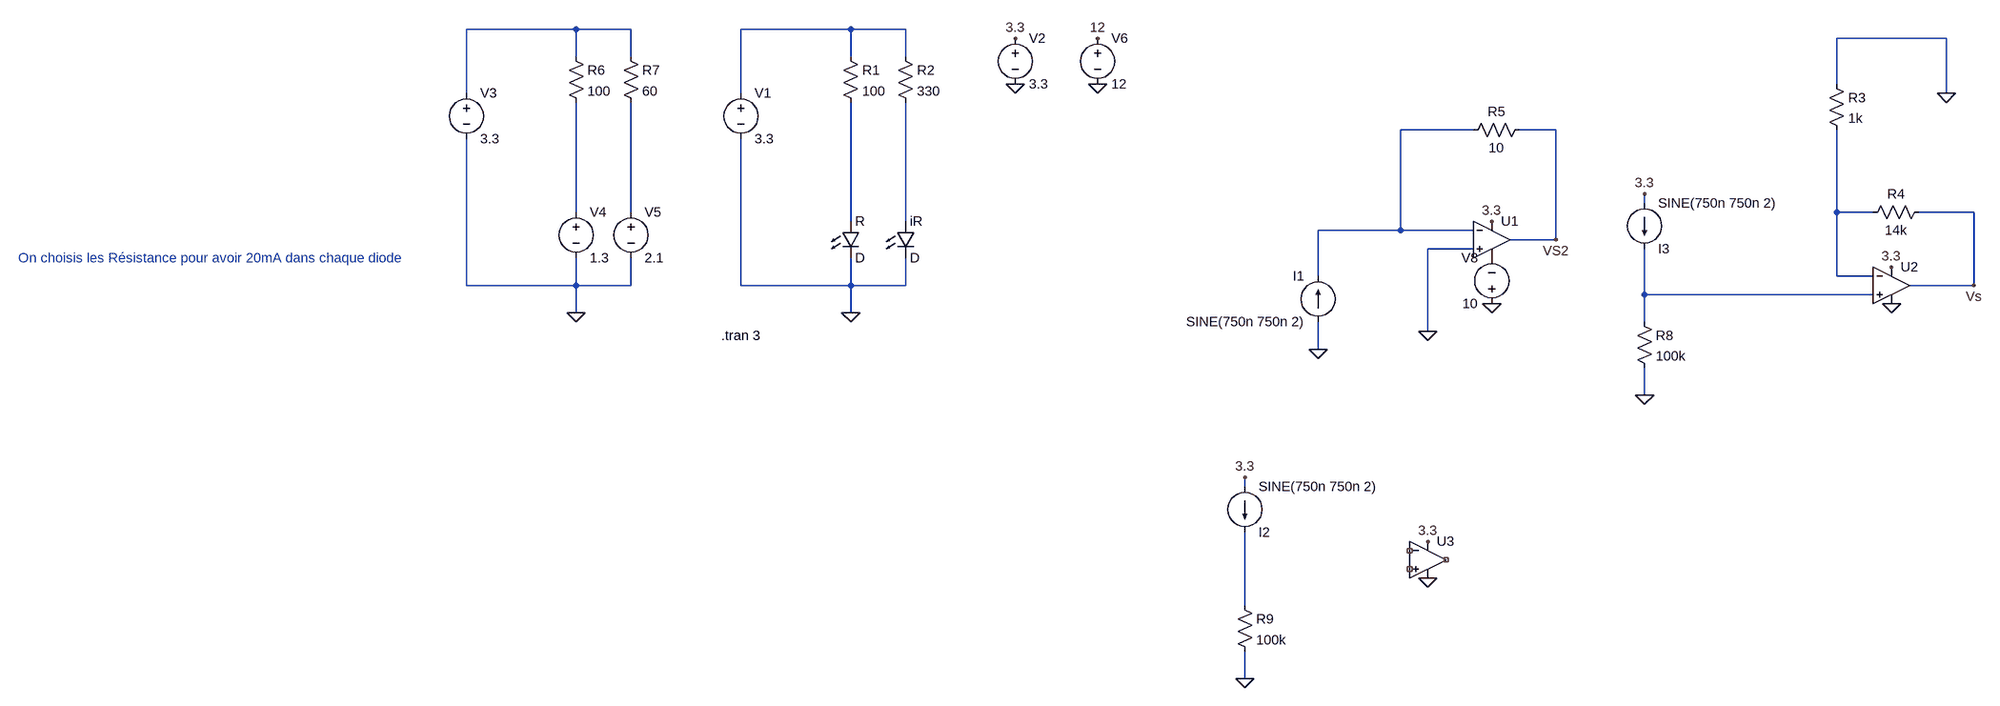
[diagram p0: schematic capteurs.asc]
capteurs.asc, the LTspice schematic file:
Version 4
SHEET 1 2576 916
WIRE -448 -240 -640 -240
WIRE -352 -240 -448 -240
WIRE 64 -240 -128 -240
WIRE 160 -240 64 -240
WIRE 2496 -224 2304 -224
WIRE -448 -192 -448 -240
WIRE -352 -192 -352 -240
WIRE 64 -192 64 -240
WIRE 160 -192 160 -240
WIRE 2304 -144 2304 -224
WIRE -640 -128 -640 -240
WIRE -128 -128 -128 -240
WIRE 2496 -128 2496 -224
WIRE 1232 -64 1104 -64
WIRE 1376 -64 1312 -64
WIRE 1968 64 1968 48
WIRE -448 80 -448 -112
WIRE -352 80 -352 -112
WIRE 2304 80 2304 -64
WIRE 2368 80 2304 80
WIRE 2544 80 2448 80
WIRE 64 96 64 -112
WIRE 160 96 160 -112
WIRE 1104 112 1104 -64
WIRE 1104 112 960 112
WIRE 1232 112 1104 112
WIRE 1376 128 1376 -64
WIRE 1376 128 1296 128
WIRE 1232 144 1152 144
WIRE 960 192 960 112
WIRE 2304 192 2304 80
WIRE 2368 192 2304 192
WIRE -640 208 -640 -48
WIRE -448 208 -448 160
WIRE -448 208 -640 208
WIRE -352 208 -352 160
WIRE -352 208 -448 208
WIRE -128 208 -128 -48
WIRE 64 208 64 160
WIRE 64 208 -128 208
WIRE 160 208 160 160
WIRE 160 208 64 208
WIRE 2544 208 2544 80
WIRE 2544 208 2432 208
WIRE 1968 224 1968 144
WIRE 2368 224 1968 224
WIRE -448 256 -448 208
WIRE 64 256 64 208
WIRE 1968 272 1968 224
WIRE 1152 288 1152 144
WIRE 960 320 960 272
WIRE 1968 400 1968 352
WIRE 832 560 832 544
WIRE 832 768 832 640
WIRE 832 896 832 848
FLAG 64 256 0
FLAG 352 -224 3.3
FLAG 352 -144 0
FLAG -448 256 0
FLAG 2400 176 3.3
FLAG 2400 240 0
FLAG 2544 208 Vs
FLAG 2496 -128 0
FLAG 496 -224 12
FLAG 496 -144 0
FLAG 960 320 0
FLAG 1264 96 3.3
FLAG 1152 288 0
FLAG 1376 128 VS2
FLAG 1264 240 0
FLAG 832 896 0
FLAG 832 544 3.3
FLAG 1152 656 3.3
FLAG 1152 720 0
FLAG 1968 400 0
FLAG 1968 48 3.3
SYMBOL LED 48 96 R0
SYMATTR InstName R
SYMBOL LED 144 96 R0
SYMATTR InstName iR
SYMBOL res 48 -208 R0
SYMATTR InstName R1
SYMATTR Value 100
SYMBOL res 144 -208 R0
SYMATTR InstName R2
SYMATTR Value 330
SYMBOL voltage -128 -144 R0
SYMATTR InstName V1
SYMATTR Value 3.3
SYMBOL voltage 352 -240 R0
WINDOW 123 0 0 Left 0
WINDOW 39 0 0 Left 0
SYMATTR InstName V2
SYMATTR Value 3.3
SYMBOL res -464 -208 R0
SYMATTR InstName R6
SYMATTR Value 100
SYMBOL res -368 -208 R0
SYMATTR InstName R7
SYMATTR Value 60
SYMBOL voltage -640 -144 R0
SYMATTR InstName V3
SYMATTR Value 3.3
SYMBOL voltage -448 64 R0
SYMATTR InstName V4
SYMATTR Value 1.3
SYMBOL voltage -352 64 R0
SYMATTR InstName V5
SYMATTR Value 2.1
SYMBOL res 2464 64 R90
WINDOW 0 0 56 VBottom 2
WINDOW 3 32 56 VTop 2
SYMATTR InstName R4
SYMATTR Value 14k
SYMBOL OpAmps\\UniversalOpamp2 2400 208 R0
SYMATTR InstName U2
SYMBOL res 2288 -160 R0
SYMATTR InstName R3
SYMATTR Value 1k
SYMBOL voltage 496 -240 R0
WINDOW 123 0 0 Left 0
WINDOW 39 0 0 Left 0
SYMATTR InstName V6
SYMATTR Value 12
SYMBOL current 960 272 R180
WINDOW 0 24 80 Left 2
WINDOW 3 24 0 Left 2
WINDOW 123 0 0 Left 0
WINDOW 39 0 0 Left 0
SYMATTR InstName I1
SYMATTR Value SINE(750n 750n 2)
SYMBOL OpAmps\\UniversalOpamp2 1264 128 R0
SYMATTR InstName U1
SYMBOL res 1328 -80 R90
WINDOW 0 0 56 VBottom 2
WINDOW 3 32 56 VTop 2
SYMATTR InstName R5
SYMATTR Value 10
SYMBOL voltage 1264 256 R180
WINDOW 0 24 96 Left 2
WINDOW 3 24 16 Left 2
SYMATTR InstName V8
SYMATTR Value 10
SYMBOL current 832 560 R0
WINDOW 0 24 80 Left 2
WINDOW 3 24 0 Left 2
WINDOW 123 0 0 Left 0
WINDOW 39 0 0 Left 0
SYMATTR InstName I2
SYMATTR Value SINE(750n 750n 2)
SYMBOL res 816 752 R0
SYMATTR InstName R9
SYMATTR Value 100k
SYMBOL OpAmps\\UniversalOpamp2 1152 688 R0
SYMATTR InstName U3
SYMBOL current 1968 64 R0
WINDOW 0 24 80 Left 2
WINDOW 3 24 0 Left 2
WINDOW 123 0 0 Left 0
WINDOW 39 0 0 Left 0
SYMATTR InstName I3
SYMATTR Value SINE(750n 750n 2)
SYMBOL res 1952 256 R0
SYMATTR InstName R8
SYMATTR Value 100k
TEXT -162 296 Left 2 !.tran 3
TEXT -1424 160 Left 2 ;On choisis les Résistance pour avoir 20mA dans chaque diode

The netlist it stands for:
* capteurs.asc
D§R N007 0 D
D§iR N008 0 D
R1 N002 N007 100
R2 N002 N008 330
V1 N002 0 3.3
V2 3.3 0 3.3
R6 N001 N004 100
R7 N001 N005 60
V3 N001 0 3.3
V4 N004 0 1.3
V5 N005 0 2.1
R4 Vs N006 14k
XU2 N009 N006 3.3 0 Vs level.2 Avol=1Meg GBW=10Meg Slew=10Meg ilimit=25m rail=0 Vos=0 phimargin=45 en=0 enk=0 in=0 ink=0 Rin=500Meg  ; pins IN+ IN- V+ V- OUT
R3 0 N006 1k
V6 12 0 12
I1 0 N003 SINE(750n 750n 2)
XU1 0 N003 3.3 P001 VS2 level.2 Avol=1Meg GBW=10Meg Slew=10Meg ilimit=25m rail=0 Vos=0 phimargin=45 en=0 enk=0 in=0 ink=0 Rin=500Meg  ; pins IN+ IN- V+ V- OUT
R5 VS2 N003 10
V8 0 P001 10
I2 3.3 N010 SINE(750n 750n 2)
R9 N010 0 100k
XU3 NC_01 NC_02 3.3 0 NC_03 level.2 Avol=1Meg GBW=10Meg Slew=10Meg ilimit=25m rail=0 Vos=0 phimargin=45 en=0 enk=0 in=0 ink=0 Rin=500Meg  ; pins IN+ IN- V+ V- OUT
I3 3.3 N009 SINE(750n 750n 2)
R8 N009 0 100k
.model D D
.lib standard.dio
.tran 3
* On choisis les Résistance pour avoir 20mA dans chaque diode
.lib UniversalOpamps2.sub
.backanno
.end